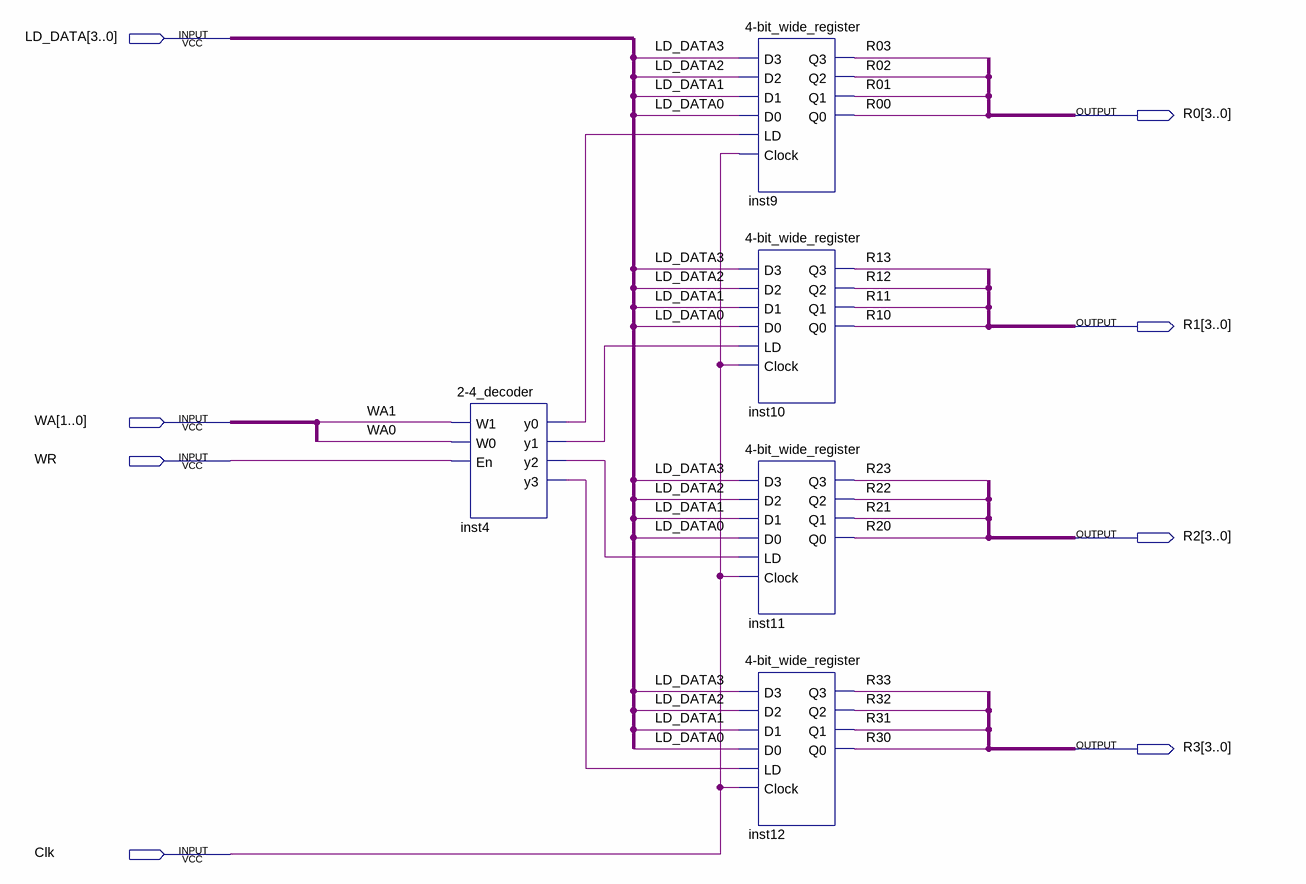
[diagram p0: schematic sheet]
// Quartus schematic register_file.bdf as structural Verilog: 5 symbols, 8 pins
module register_file (
  input  [3:0] LD_DATA,
  input  [1:0] WA,
  input  WR,
  input  Clk,
  output [3:0] R0,
  output [3:0] R1,
  output [3:0] R2,
  output [3:0] R3
);

  wire inst4_y0, inst4_y1, inst4_y2, inst4_y3;

  \2-4_decoder  inst4 (.W1(WA[1]), .W0(WA[0]), .En(WR), .y0(inst4_y0), .y1(inst4_y1), .y2(inst4_y2), .y3(inst4_y3));
  \4-bit_wide_register  inst9 (
    .D3(LD_DATA[3]), .D2(LD_DATA[2]), .D1(LD_DATA[1]), .D0(LD_DATA[0]), .LD(inst4_y0), .Clock(Clk),
    .Q3(R0[3]), .Q2(R0[2]), .Q1(R0[1]), .Q0(R0[0]));
  \4-bit_wide_register  inst10 (
    .D3(LD_DATA[3]), .D2(LD_DATA[2]), .D1(LD_DATA[1]), .D0(LD_DATA[0]), .LD(inst4_y1), .Clock(Clk),
    .Q3(R1[3]), .Q2(R1[2]), .Q1(R1[1]), .Q0(R1[0]));
  \4-bit_wide_register  inst11 (
    .D3(LD_DATA[3]), .D2(LD_DATA[2]), .D1(LD_DATA[1]), .D0(LD_DATA[0]), .LD(inst4_y2), .Clock(Clk),
    .Q3(R2[3]), .Q2(R2[2]), .Q1(R2[1]), .Q0(R2[0]));
  \4-bit_wide_register  inst12 (
    .D3(LD_DATA[3]), .D2(LD_DATA[2]), .D1(LD_DATA[1]), .D0(LD_DATA[0]), .LD(inst4_y3), .Clock(Clk),
    .Q3(R3[3]), .Q2(R3[2]), .Q1(R3[1]), .Q0(R3[0]));
endmodule
